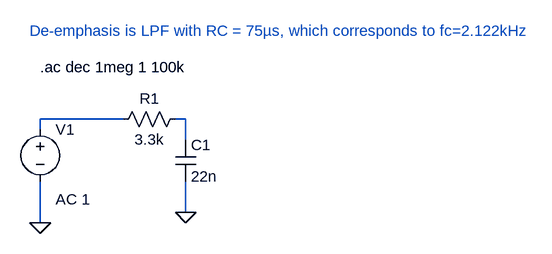
[diagram p0: schematic de-emphasis.asc]
de-emphasis.asc, the LTspice schematic file:
Version 4
SHEET 1 880 680
WIRE 16 96 -112 96
WIRE 112 96 96 96
WIRE -112 112 -112 96
WIRE 112 128 112 96
WIRE 112 240 112 192
WIRE -112 256 -112 192
FLAG -112 256 0
FLAG 112 240 0
SYMBOL res 112 80 R90
WINDOW 0 0 56 VBottom 2
WINDOW 3 32 56 VTop 2
SYMATTR InstName R1
SYMATTR Value 3.3k
SYMBOL voltage -112 96 R0
WINDOW 123 24 124 Left 2
WINDOW 39 0 0 Left 0
SYMATTR Value2 AC 1
SYMATTR InstName V1
SYMATTR Value ""
SYMBOL cap 96 128 R0
SYMATTR InstName C1
SYMATTR Value 22n
TEXT -112 16 Left 2 !.ac dec 1meg 1 100k
TEXT -128 -40 Left 2 ;De-emphasis is LPF with RC = 75µs, which corresponds to fc=2.122kHz

The netlist it stands for:
* de-emphasis.asc
R1 N002 N001 3.3k
V1 N001 0 AC 1
C1 N002 0 22n
.ac dec 1meg 1 100k
* De-emphasis is LPF with RC = 75µs, which corresponds to fc=2.122kHz
.backanno
.end